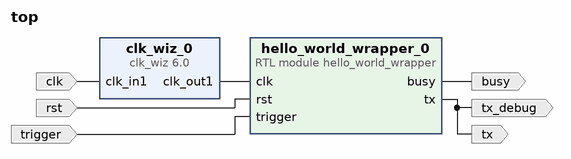
[diagram p0: block diagram of the top level]
# Vivado block design top, xc7a35ticsg324-1L, Vivado 2023.2
create_bd_design top

create_bd_port -dir I -type clk clk
set_property -dict {CONFIG.FREQ_HZ 100000000} [get_bd_ports clk]
create_bd_port -dir I -type rst rst
set_property -dict {CONFIG.POLARITY ACTIVE_HIGH} [get_bd_ports rst]
create_bd_port -dir I -type data trigger
create_bd_port -dir O -type data tx
create_bd_port -dir O -type data busy
create_bd_port -dir O -type data tx_debug

create_bd_cell -type ip -vlnv xilinx.com:ip:clk_wiz:6.0 clk_wiz_0
set_property -dict {CONFIG.USE_RESET false} [get_bd_cells clk_wiz_0]
create_bd_cell -type module -reference hello_world_wrapper hello_world_wrapper_0

# ---- connections ----

connect_bd_net [get_bd_ports clk] [get_bd_pins clk_wiz_0/clk_in1]
connect_bd_net [get_bd_pins clk_wiz_0/clk_out1] [get_bd_pins hello_world_wrapper_0/clk]
connect_bd_net [get_bd_pins hello_world_wrapper_0/busy] [get_bd_ports busy]
connect_bd_net [get_bd_pins hello_world_wrapper_0/tx] [get_bd_ports tx] [get_bd_ports tx_debug]
connect_bd_net [get_bd_ports rst] [get_bd_pins hello_world_wrapper_0/rst]
connect_bd_net [get_bd_ports trigger] [get_bd_pins hello_world_wrapper_0/trigger]

validate_bd_design
save_bd_design
